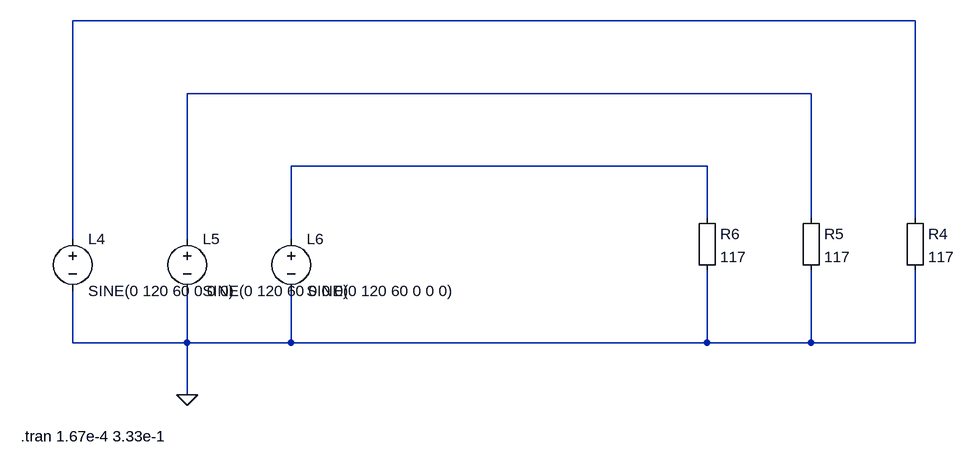
[diagram p0: schematic 3_Phasen_4_Leitersystem.asc]
3_Phasen_4_Leitersystem.asc, the LTspice schematic file:
Version 4
SHEET 1 880 680
WIRE 144 560 144 576
WIRE 320 560 320 576
WIRE 480 560 480 576
WIRE 1120 448 1120 368
WIRE 1120 368 480 368
WIRE 480 368 480 480
WIRE 1280 448 1280 256
WIRE 1280 256 320 256
WIRE 320 256 320 480
WIRE 144 480 144 144
WIRE 144 144 1440 144
WIRE 1440 144 1440 448
WIRE 480 576 480 640
WIRE 320 640 144 640
WIRE 144 640 144 576
WIRE 320 576 320 640
WIRE 1280 640 1440 640
WIRE 1440 640 1440 528
WIRE 1280 528 1280 640
WIRE 320 720 320 640
WIRE 480 640 320 640
WIRE 480 640 1120 640
WIRE 1120 640 1280 640
WIRE 1120 528 1120 640
FLAG 320 720 0
SYMBOL voltage 144 464 R0
SYMATTR InstName L4
SYMATTR Value SINE(0 120 60 0 0 0)
SYMBOL voltage 320 464 R0
SYMATTR InstName L5
SYMATTR Value SINE(0 120 60 0 0 0)
SYMBOL voltage 480 464 R0
SYMATTR InstName L6
SYMATTR Value SINE(0 120 60 0 0 0)
SYMBOL Misc\EuropeanResistor 1424 432 R0
SYMATTR InstName R4
SYMATTR Value 117
SYMBOL Misc\EuropeanResistor 1264 432 R0
SYMATTR InstName R5
SYMATTR Value 117
SYMBOL Misc\EuropeanResistor 1104 432 R0
SYMATTR InstName R6
SYMATTR Value 117
TEXT 64 784 Left 2 !.tran 1.67e-4 3.33e-1

The netlist it stands for:
* 3_Phasen_4_Leitersystem.asc
V§L4 N003 0 SINE(0 120 60 0 0 0)
V§L5 N002 0 SINE(0 120 60 0 0 0)
V§L6 N001 0 SINE(0 120 60 0 0 0)
R4 N003 0 117
R5 N002 0 117
R6 N001 0 117
.tran 1.67e-4 3.33e-1
.backanno
.end